# EasyEDA schematic SCH_lucid vr proto 5 pcbs_2023-09-04.json
TITLE: LucidVR X JuliLeThing proto 5 pcbs; REV: 1.0; Date: 2023-08-29; Sheet: 1/1; Drawn By: JuliLeThing; Company: JuliLeThing
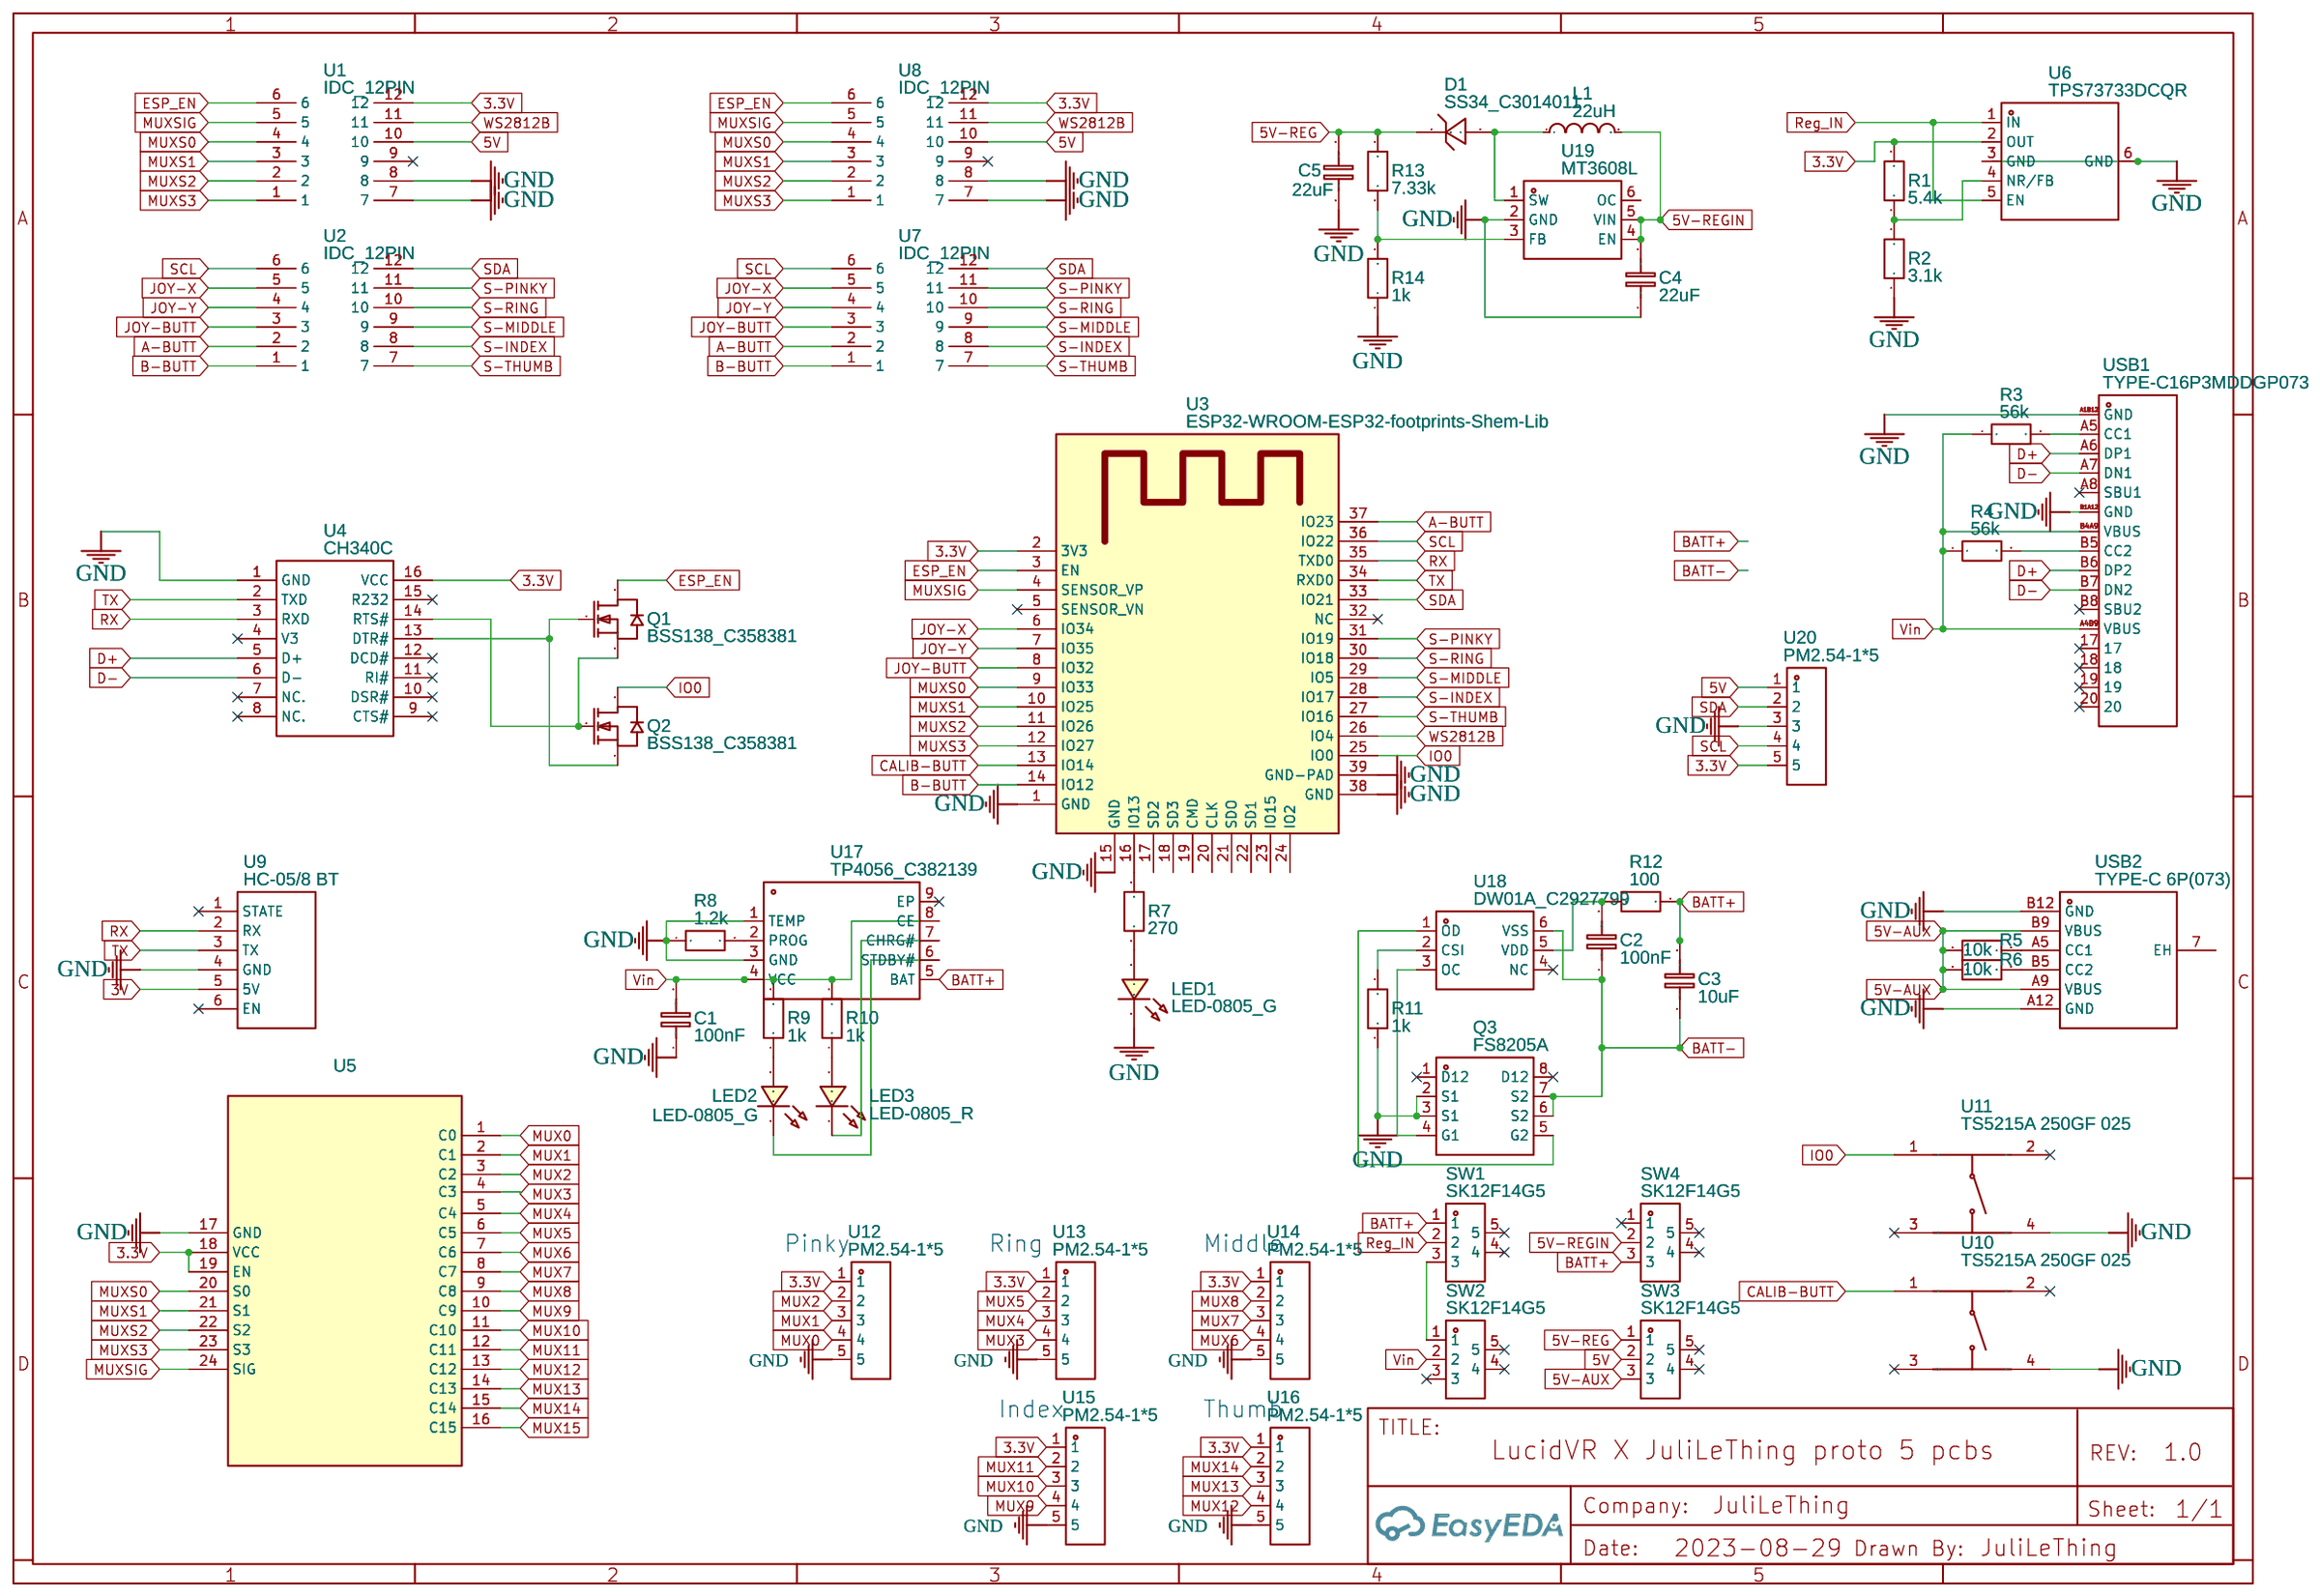
[diagram p0: schematic sheet]

## Parts
C1  100nF  [C1206]
C2  100nF  [C1206]
C3  10uF  [C1206]
C4  22uF  [C1206]
C5  22uF  [C1206]
D1  SS34_C3014011  [SMA_L4.3-W2.7-LS5.1-RD]
L1  22uH  [L0805]
LED1  LED-0805_G  [LED0805_GREEN]
LED2  LED-0805_G  [LED0805_GREEN]
LED3  LED-0805_R  [LED0805_RED]
Q1  BSS138_C358381  [SOT-23-3_L2.9-W1.6-P1.90-LS2.8-BR]
Q2  BSS138_C358381  [SOT-23-3_L2.9-W1.6-P1.90-LS2.8-BR]
Q3  FS8205A  [TSSOP-8_L4.4-W3.0-P0.65-LS6.4-BL-2]
R1  5.4k  [R1206]
R2  3.1k  [R1206]
R3  56k  [R1206]
R4  56k  [R1206]
R5  10k  [R1206]
R6  10k  [R1206]
R7  270  [R1206]
R8  1.2k  [R1206]
R9  1k  [R1206]
R10  1k  [R1206]
R11  1k  [R1206]
R12  100  [R1206]
R13  7.33k  [R1206]
R14  1k  [R1206]
SW1  SK12F14G5  [SW-TH_SK12F14G5]
SW2  SK12F14G5  [SW-TH_SK12F14G5]
SW3  SK12F14G5  [SW-TH_SK12F14G5]
SW4  SK12F14G5  [SW-TH_SK12F14G5]
U1  IDC_12PIN  [IDC_12PIN]
U2  IDC_12PIN  [IDC_12PIN]
U3  ESP32-WROOM-ESP32-footprints-Shem-Lib  [ESP32-WROOM]
U4  CH340C  [SOP-16_L10.0-W3.9-P1.27-LS6.0-BL]
U5  NO  [CD74HC4067]
U6  TPS73733DCQR  [SOT-223-6_L6.5-W3.5-P1.27-BL]
U7  IDC_12PIN  [IDC_12PIN]
U8  IDC_12PIN  [IDC_12PIN]
U9  HC-05/8 BT  [HC08 BLUETOOTH MODULE]
U10  TS5215A 250GF 025  [SW-SMD_4P-L5.2-W5.2-P3.70-LS6.4]
U11  TS5215A 250GF 025  [SW-SMD_4P-L5.2-W5.2-P3.70-LS6.4]
U12  PM2.54-1*5  [HDR-TH_5P-P2.54-V-F]
U13  PM2.54-1*5  [HDR-TH_5P-P2.54-V-F]
U14  PM2.54-1*5  [HDR-TH_5P-P2.54-V-F]
U15  PM2.54-1*5  [HDR-TH_5P-P2.54-V-F]
U16  PM2.54-1*5  [HDR-TH_5P-P2.54-V-F]
U17  TP4056_C382139  [ESOP-8_L4.9-W3.9-P1.27-LS6.0-BL-EP]
U18  DW01A_C2927799  [SOT-23-6_L2.9-W1.6-P0.95-LS2.8-BL]
U19  MT3608L  [SOT-23-6_L2.9-W1.7-P0.95-LS2.8-BL]
U20  PM2.54-1*5  [HDR-TH_5P-P2.54-V-F]
USB1  TYPE-C16P3MDDGP073  [USB-SMD_TYPE-C16PIN-1]
USB2  TYPE-C 6P(073)  [TYPE-C-SMD_TYPE-C-6P]

## Library data of the parts
C1-C5 = C_1206_EU: Contributor: LCEDA_Lib
D1 = SS34_C3014011: Contributor: lcsc; Supplier: LCSC; Supplier Part: C3014011; Manufacturer: FOSAN(富信); Manufacturer Part: SS34; JLCPCB Part Class: Extended Part; link: https://lcsc.com/eda_search?q=C3014011&%26type=1&ref=editor
L1 = L0805_US: Contributor: LCEDA_Lib
LED1 LED2 = LED-0805_G: Manufacturer: 国星光电; Manufacturer Part: NCD0805G1; Supplier Part: C84260; Contributor: LCEDA_Lib
LED3 = LED-0805_R: Manufacturer: EVERLIGHT(台湾亿光); Manufacturer Part: 17-21SURC/S530-A3/TR8; Supplier Part: C72037; Contributor: LCEDA_Lib
Q1 Q2 = BSS138_C358381: Contributor: LCSC; Supplier: LCSC; Supplier Part: C358381; Manufacturer: BLUE ROCKET(蓝箭); Manufacturer Part: BSS138; JLCPCB Part Class: Extended Part; link: https://lcsc.com/eda_search?q=C358381&%26type=1&ref=editor
Q3 = FS8205A: Supplier: LCSC; Manufacturer: FORTUNE(富晶); Supplier Part: C16052; JLCPCB Part Class: Extended Part; link: https://lcsc.com/eda_search?q=C16052&%26type=1&ref=editor
R1-R14 = R_1206_EU: Contributor: LCEDA_Lib
SW1-SW4 = SK12F14G5: Contributor: LCSC; Supplier: LCSC; Supplier Part: C2887263; Manufacturer: SHOU HAN(首韩); JLCPCB Part Class: Extended Part; link: https://lcsc.com/eda_search?q=C2887263&%26type=1&ref=editor
U1 U2 U7 U8 = IDC_12PIN: Contributor: fabi_creates
U3 = ESP32-WROOM-ESP32-footprints-Shem-Lib: Contributor: werleybrito
U4 = CH340C: Supplier: LCSC; Manufacturer: WCH(南京沁恒); Supplier Part: C84681; JLCPCB Part Class: Extended Part; link: https://lcsc.com/eda_search?q=C84681&%26type=1&ref=editor
U5 = 16x1_Mux_board_CD74HC4067: sourceId: 1T5FDZYC8; Contributor: kachappilly
U6 = TPS73733DCQR: Supplier: LCSC; Manufacturer: TI(德州仪器); Supplier Part: C31334; JLCPCB Part Class: Extended Part; link: https://lcsc.com/eda_search?q=C31334&%26type=1&ref=editor
U9 = HC08 Bluetooth Module: Contributor: krcpcb
U10 U11 = TS5215A 250GF 025: Contributor: lcsc; Supplier: LCSC; Supplier Part: C5140332; Manufacturer: SHOU HAN(首韩); Manufacturer Part: TS5215A 250gf 025; link: https://lcsc.com/eda_search?q=C5140332&%26type=1&ref=editor
U12-U16 U20 = PM2.54-1*5: Contributor: lcsc; Supplier: LCSC; Supplier Part: C5116488; Manufacturer: ZHOURI(洲日); JLCPCB Part Class: Extended Part; link: https://lcsc.com/eda_search?q=C5116488&%26type=1&ref=editor
U17 = TP4056_C382139: Contributor: LCSC; Supplier: LCSC; Supplier Part: C382139; Manufacturer: TPOWER(天源); Manufacturer Part: TP4056; JLCPCB Part Class: Extended Part; link: https://lcsc.com/eda_search?q=C382139&%26type=1&ref=editor
U18 = DW01A_C2927799: Contributor: LCSC; Supplier: LCSC; Supplier Part: C2927799; Manufacturer: YONGYUTAI(永裕泰); Manufacturer Part: DW01A; JLCPCB Part Class: Extended Part; link: https://lcsc.com/eda_search?q=C2927799&%26type=1&ref=editor
U19 = MT3608L: Contributor: LCSC; Supplier: LCSC; Supplier Part: C2932326; Manufacturer: 西安航天民芯; JLCPCB Part Class: Extended Part; link: https://lcsc.com/eda_search?q=C2932326&%26type=1&ref=editor
USB1 = TYPE-C16P3MDDGP073: Contributor: LCSC; Supplier: LCSC; Supplier Part: C2965608; Manufacturer: SHOU HAN(首韩); JLCPCB Part Class: Extended Part; link: https://lcsc.com/eda_search?q=C2965608&%26type=1&ref=editor
USB2 = TYPE-C 6P(073): Contributor: LCSC; Supplier: LCSC; Supplier Part: C668623; Manufacturer: SHOU HAN(首韩); JLCPCB Part Class: Extended Part; link: https://lcsc.com/eda_search?q=C668623&%26type=1&ref=editor

## Nets
3.3V: R1.2 U1.12 U3.2(3V3) U4.16(VCC) U5.18(VCC) U5.19(EN) U6.2(OUT) U8.12 U12.1 U13.1 U14.1 U15.1 U16.1 U20.5
3V: U9.5(5V)
5V: SW3.2 U1.10 U8.10 U20.1
5V-AUX: R5.1 R6.1 SW3.3 USB2.A9(VBUS) USB2.B9(VBUS)
5V-REG: C5.2 D1.1(C) R13.2 SW3.1
5V-REGIN: C4.2 L1.2 SW4.2 U19.4(EN) U19.5(VIN)
GND: C1.1 C4.1 C5.1 LED1.2 Q3.2(S1) Q3.3(S1) R2.1 R8.1 R11.1 R14.1 U1.7 U1.8 U3.1(GND) U3.15(GND) U3.38(GND) U3.39(GND-PAD) U4.1(GND) U5.17(GND) U6.6(GND) U8.7 U8.8 U9.4(GND) U10.4 U11.4 U12.5 U13.5 U14.5 U15.5 U16.5 U17.1(TEMP) U17.3(GND) U19.2(GND) U20.3 USB1.A1B12(GND) USB1.B1A12(GND) USB2.A12(GND) USB2.B12(GND)
Vin: C1.2 R3.1 R4.1 R9.2 R10.2 SW2.2 U17.4(VCC) U17.8(CE) USB1.A4B9(VBUS) USB1.B4A9(VBUS)
A-BUTT: U2.2 U3.37(IO23) U7.2
B-BUTT: U2.1 U3.14(IO12) U7.1
BATT+: C3.2 R12.2 SW1.1 SW4.3 U17.5(BAT)
BATT-: C2.1 C3.1 Q3.6(S2) Q3.7(S2) U18.6(VSS)
CALIB-BUTT: U3.13(IO14) U10.1
D+: U4.5(D+) USB1.A6(DP1) USB1.B6(DP2)
D-: U4.6(D-) USB1.A7(DN1) USB1.B7(DN2)
ESP_EN: Q1.3(D) U1.6 U3.3(EN) U8.6
IO0: Q2.3(D) U3.25(IO0) U11.1
JOY-BUTT: U2.3 U3.8(IO32) U7.3
JOY-X: U2.5 U3.6(IO34) U7.5
JOY-Y: U2.4 U3.7(IO35) U7.4
MUX0: U5.1(C0) U12.4
MUX1: U5.2(C1) U12.3
MUX2: U5.3(C2) U12.2
MUX3: U5.4(C3) U13.4
MUX4: U5.5(C4) U13.3
MUX5: U5.6(C5) U13.2
MUX6: U5.7(C6) U14.4
MUX7: U5.8(C7) U14.3
MUX8: U5.9(C8) U14.2
MUX9: U5.10(C9) U15.4
MUX10: U5.11(C10) U15.3
MUX11: U5.12(C11) U15.2
MUX12: U5.13(C12) U16.4
MUX13: U5.14(C13) U16.3
MUX14: U5.15(C14) U16.2
MUX15: U5.16(C15)
MUXS0: U1.4 U3.9(IO33) U5.20(S0) U8.4
MUXS1: U1.3 U3.10(IO25) U5.21(S1) U8.3
MUXS2: U1.2 U3.11(IO26) U5.22(S2) U8.2
MUXS3: U1.1 U3.12(IO27) U5.23(S3) U8.1
MUXSIG: U1.5 U3.4(SENSOR_VP) U5.24(SIG) U8.5
Reg_IN: SW1.2 U6.1(IN) U6.5(EN)
RX: U3.35(TXD0) U4.3(RXD) U9.2(RX)
S-INDEX: U2.8 U3.28(IO17) U7.8
S-MIDDLE: U2.9 U3.29(IO5) U7.9
S-PINKY: U2.11 U3.31(IO19) U7.11
S-RING: U2.10 U3.30(IO18) U7.10
S-THUMB: U2.7 U3.27(IO16) U7.7
SCL: U2.6 U3.36(IO22) U7.6 U20.4
SDA: U2.12 U3.33(IO21) U7.12 U20.2
TX: U3.34(RXD0) U4.2(TXD) U9.3(TX)
WS2812B: U1.11 U3.26(IO4) U8.11
Net-(C2-2): C2.2 R12.1 U18.5(VDD)
Net-(D1-2): D1.2(A) L1.1 U19.1(SW)
Net-(LED1-1): LED1.1 R7.2
Net-(LED2-1): LED2.1 R9.1
Net-(LED2-2): LED2.2 U17.6(STDBY#)
Net-(LED3-1): LED3.1 R10.1
Net-(LED3-2): LED3.2 U17.7(CHRG#)
Net-(Q1-1): Q1.1(G) Q2.2(S) U4.13(DTR#)
Net-(Q1-2): Q1.2(S) Q2.1(G) U4.14(RTS#)
Net-(Q3-4): Q3.4(G1) U18.3(OC)
Net-(Q3-5): Q3.5(G2) U18.1(OD)
Net-(R1-1): R1.1 R2.2 U6.4(NR/FB)
Net-(R3-2): R3.2 USB1.A5(CC1)
Net-(R4-2): R4.2 USB1.B5(CC2)
Net-(R5-2): R5.2 USB2.A5(CC1)
Net-(R6-2): R6.2 USB2.B5(CC2)
Net-(R7-1): R7.1 U3.16(IO13)
Net-(R8-2): R8.2 U17.2(PROG)
Net-(R11-2): R11.2 U18.2(CSI)
Net-(R13-1): R13.1 R14.2 U19.3(FB)
Net-(SW1-3): SW1.3 SW2.1

Not connected (* = marked no-connect by the designer): Q3 1(D12)* 8(D12)*; SW1 4* 5*; SW2 3* 4* 5*; SW3 4* 5*; SW4 1* 4* 5*; U1 9*; U3 5(SENSOR_VN)* 17(SD2) 18(SD3) 19(CMD) 20(CLK) 21(SDO) 22(SD1) 23(IO15) 24(IO2) 32(NC)*; U4 4(V3)* 7(NC.)* 8(NC.)* 9(CTS#)* 10(DSR#)* 11(RI#)* 12(DCD#)* 15(R232)*; U6 3(GND); U8 9*; U9 1(STATE)* 6(EN)*; U10 2* 3*; U11 2* 3*; U17 9(EP)*; U18 4(NC)*; U19 6(OC); USB1 17* 18* 19* 20* A8(SBU1)* B8(SBU2)*; USB2 7(EH)

## Notes on the sheet
- Pinky
- Ring
- Middle
- Index
- Thumb
